# Altium schematic sheet Connector B.SchDoc: CONNECTOR B
size A4; DrawnBy: ELIO F.; Engineer: ELIO F.; Revision: A; SheetNumber: 16; SheetTotal: 20
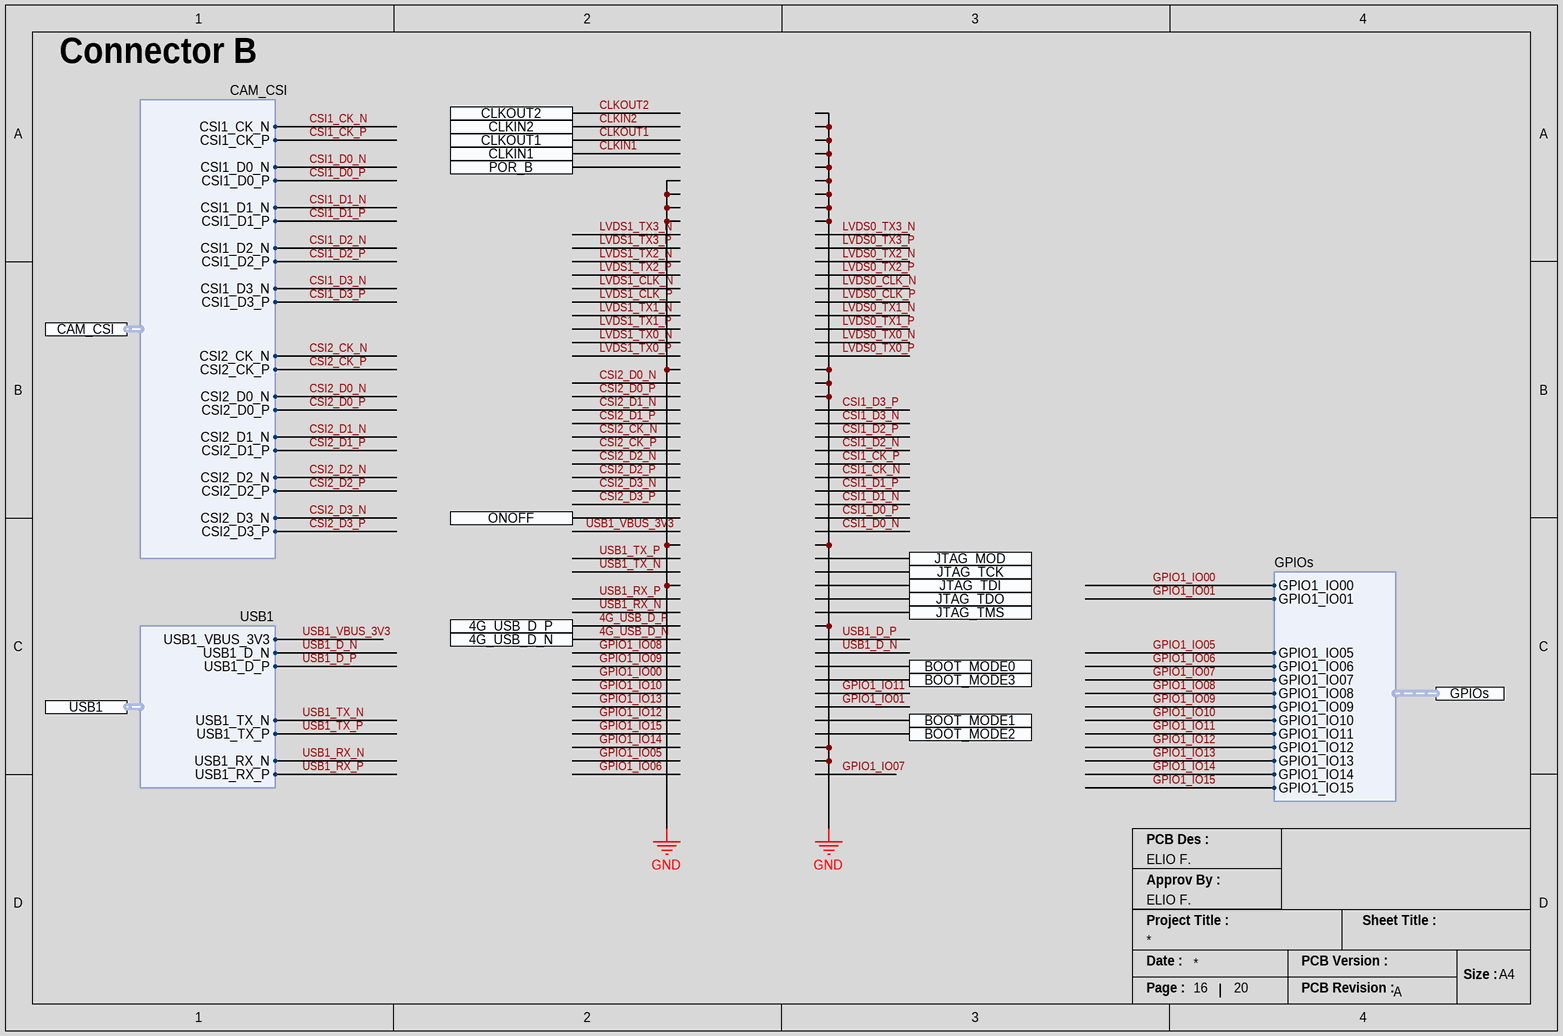
[diagram p0: Connector B.SchDoc]

## Ports
4G_USB_D_N, 4G_USB_D_P, BOOT_MODE0, BOOT_MODE1, BOOT_MODE2, BOOT_MODE3, CAM_CSI (harness CAM_CSI), CLKIN1, CLKIN2, CLKOUT1, CLKOUT2, GPIOs (harness GPIOs), JTAG_MOD, JTAG_TCK, JTAG_TDI, JTAG_TDO, JTAG_TMS, ONOFF, POR_B, USB1 (harness USB1)

## Harnesses
CAM_CSI: CSI1_CK_N, CSI1_CK_P, CSI1_D0_N, CSI1_D0_P, CSI1_D1_N, CSI1_D1_P, CSI1_D2_N, CSI1_D2_P, CSI1_D3_N, CSI1_D3_P, CSI2_CK_N, CSI2_CK_P, CSI2_D0_N, CSI2_D0_P, CSI2_D1_N, CSI2_D1_P, CSI2_D2_N, CSI2_D2_P, CSI2_D3_N, CSI2_D3_P
USB1: USB1_VBUS_3V3, USB1_D_N, USB1_D_P, USB1_TX_N, USB1_TX_P, USB1_RX_N, USB1_RX_P
GPIOs: GPIO1_IO00, GPIO1_IO01, GPIO1_IO05, GPIO1_IO06, GPIO1_IO07, GPIO1_IO08, GPIO1_IO09, GPIO1_IO10, GPIO1_IO11, GPIO1_IO12, GPIO1_IO13, GPIO1_IO14, GPIO1_IO15

## Nets
4G_USB_D_N: port 4G_USB_D_N
4G_USB_D_P: port 4G_USB_D_P
CLKIN1: port CLKIN1
CLKIN2: port CLKIN2
CLKOUT1: port CLKOUT1
CLKOUT2: port CLKOUT2
CSI1_CK_N: port CAM_CSI.CSI1_CK_N
CSI1_CK_P: port CAM_CSI.CSI1_CK_P
CSI1_D0_N: port CAM_CSI.CSI1_D0_N
CSI1_D0_P: port CAM_CSI.CSI1_D0_P
CSI1_D1_N: port CAM_CSI.CSI1_D1_N
CSI1_D1_P: port CAM_CSI.CSI1_D1_P
CSI1_D2_N: port CAM_CSI.CSI1_D2_N
CSI1_D2_P: port CAM_CSI.CSI1_D2_P
CSI1_D3_N: port CAM_CSI.CSI1_D3_N
CSI1_D3_P: port CAM_CSI.CSI1_D3_P
CSI2_CK_N: port CAM_CSI.CSI2_CK_N
CSI2_CK_P: port CAM_CSI.CSI2_CK_P
CSI2_D0_N: port CAM_CSI.CSI2_D0_N
CSI2_D0_P: port CAM_CSI.CSI2_D0_P
CSI2_D1_N: port CAM_CSI.CSI2_D1_N
CSI2_D1_P: port CAM_CSI.CSI2_D1_P
CSI2_D2_N: port CAM_CSI.CSI2_D2_N
CSI2_D2_P: port CAM_CSI.CSI2_D2_P
CSI2_D3_N: port CAM_CSI.CSI2_D3_N
CSI2_D3_P: port CAM_CSI.CSI2_D3_P
GPIO1_IO00: port GPIOs.GPIO1_IO00
GPIO1_IO01: port GPIOs.GPIO1_IO01
GPIO1_IO05: port GPIOs.GPIO1_IO05
GPIO1_IO06: port GPIOs.GPIO1_IO06
GPIO1_IO07: port GPIOs.GPIO1_IO07
GPIO1_IO08: port GPIOs.GPIO1_IO08
GPIO1_IO09: port GPIOs.GPIO1_IO09
GPIO1_IO10: port GPIOs.GPIO1_IO10
GPIO1_IO11: port GPIOs.GPIO1_IO11
GPIO1_IO12: port GPIOs.GPIO1_IO12
GPIO1_IO13: port GPIOs.GPIO1_IO13
GPIO1_IO14: port GPIOs.GPIO1_IO14
GPIO1_IO15: port GPIOs.GPIO1_IO15
USB1_D_N: port USB1.USB1_D_N
USB1_D_P: port USB1.USB1_D_P
USB1_RX_N: port USB1.USB1_RX_N
USB1_RX_P: port USB1.USB1_RX_P
USB1_TX_N: port USB1.USB1_TX_N
USB1_TX_P: port USB1.USB1_TX_P
USB1_VBUS_3V3: port USB1.USB1_VBUS_3V3

## Notes on the sheet
- Connector B
- PCB Des :
- Approv By :
- Project Title :
- Sheet Title :
- Date :
- PCB Version :
- Size :
- A4
- Page :
- PCB Revision :